# Altium schematic sheet regularCharger.SchDoc
size A4
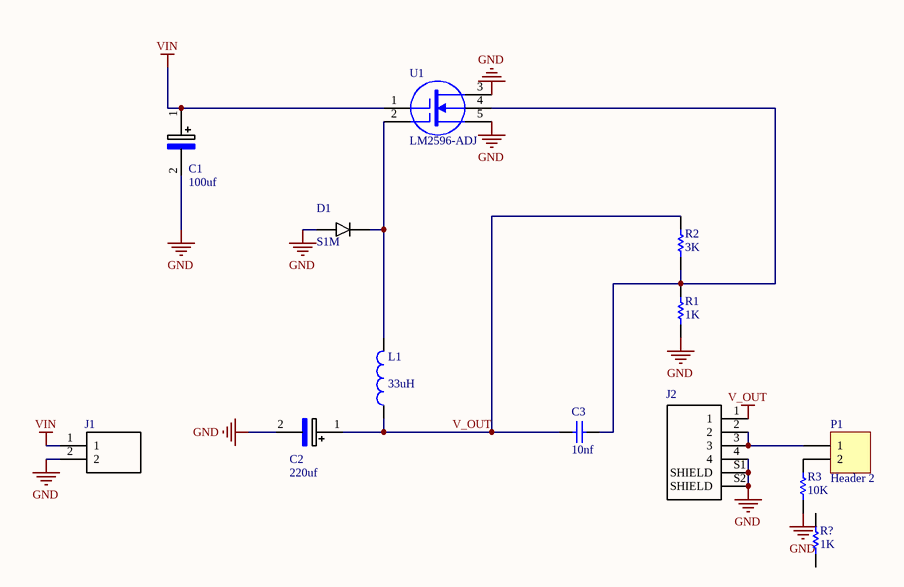
[diagram p0: regularCharger.SchDoc]

## Parts
C1  100uf  [*HAV(F)]
C2  220uf  [*HAV(F)]
C3  value 10nf  [6-0805_M]  (hidden comment: Cap)
D1  S1M  [*DIOM5227X270N_S1M(Primary)]
J1  6-1123723-2  [*TE_6-1123723-2]  (value not drawn)
J2  1-292303-1  [*TE_1-292303-1_1-292303-1(Primary)]  (value not drawn)
L1  value 33uH  [IND_SMD-13.0mm]  (hidden comment: Inductor)
P1  Header 2  [HDR1X2]
R1  value 1K  [6-0805_L]  (hidden comment: Res1)
R2  value 3K  [6-0805_L]  (hidden comment: Res1)
R3  value 10K  [6-0805_L]  (hidden comment: Res1)
R?  value 1K  [6-0805_L]  (hidden comment: Res1)
U1  LM2596-ADJ  [T05A]

## Nets
GND: C1.2(NEG) C2.2(NEG) D1.A J1.2 J2.4 J2.S1(SHIELD) J2.S2(SHIELD) R1.1 R3.1 U1.3(D) U1.5(S)
V_OUT: C2.1(POS) C3.1 J2.1 L1.1 R2.2
VIN: C1.1(POS) J1.1 U1.1(G1)
NetC3_2: C3.2 R1.2 R2.1 U1.4(U)
NetD1_C: D1.C(K) L1.2 U1.2(G2)
NetJ2_2: J2.2 J2.3 P1.1
NetP1_2: P1.2 R3.2

Not connected (* = marked no-connect by the designer): R? 1 2

## Notes on the sheet
- Title
- Size:
- Date:
- A4
- Number:
- Time:
- Revision:
- Sheet
- of
- File:

## Library data of the parts
C1 C2 = EEEHA1H101UP: Cap Aluminum 100uF 50V 20% _8 X 10.2mm_ SMD 110mA 2000 hr 105آ°C T/R; MF: Panasonic Electronic; SnapEDA_Link: https://www.snapeda.com/parts/EEEHA1H101UP/Panasonic%20Electronic%20Components/view-part/?ref=snap; MP: EEEHA1H101UP; Availability: Unavailable; Price: None; Package: Radial Panasonic Electronic; Value: *
C3 = Cap: Capacitor; Published: 8-Jun-2000; LatestRevisionDate: 17-Jul-2002; LatestRevisionNote: Re-released for DXP Platform.; PackageReference: RAD-0.3; Publisher: Altium Limited; PackageDescription: Radial Cap, Thru-Hole; 2 Leads; 0.3 in Pin Spacing
D1 = S1M: S1 Series 1000 V 1 A 1 uA Surface Mount General Purpose Rectifier - DO-214AC; MF: ON Semiconductor; Price: None; Availability: Unavailable; SnapEDA_Link: https://www.snapeda.com/parts/S1M/ON%20Semiconductor/view-part/?ref=snap; Package: DO-214AC-214 ON Semiconductor; MP: S1M; Value: *
J1 = 6-1123723-2: 3.96 EP HDR ASSY 2P_GREEN_; MF: TE Connectivity; Number_of_Positions: 2; Product_Type: Header; Centerline_Pitch: 3.96 mm[.156 in]; TE_purchase_URL: https://www.te.com/usa-en/product-6-1123723-2.html?te_bu=Cor&te_type=disp&te_campaign=seda_glo_cor-seda-global-disp-prtnr-fy19-seda-model-bom-cta_sma-317_1&elqCampaignId=32493; MP: 6-1123723-2; Price: None; Availability: Unavailable; Package: None; EU_RoHS_Compliance: Compliant; SnapEDA_Link: https://www.snapeda.com/parts/6-1123723-2/TE%20Connectivity%20AMP%20Connectors/view-part/?ref=snap; Value: *
J2 = 1-292303-1: Conn USB 2.0 Type A RCP 4 POS Solder RA SMD 4 Terminal 1 Port Box/Tray; MF: TE Connectivity; TE_purchase_URL: https://www.te.com/usa-en/product-1-292303-1.html?te_bu=Cor&te_type=disp&te_campaign=seda_glo_cor-seda-global-disp-prtnr-fy19-seda-model-bom-cta_sma-317_1&elqCampaignId=32493; SnapEDA_Link: https://www.snapeda.com/parts/1-292303-1/TE%20Connectivity%20AMP%20Connectors/view-part/?ref=snap; MP: 1-292303-1; Availability: Unavailable; Price: None; EU_RoHS_Compliance: Compliant; Package: None; Value: *
L1 = Inductor: Code_IEC: 1005; Published: 8-Jun-2000; LatestRevisionDate: 29-May-2009; LatestRevisionNote: IPC-7351 Footprint Added.; PackageReference: 0402-A; Publisher: Altium Limited; PackageDescription: Chip Inductor; Code_JEITA: 0402
P1 = Header 2: Header, 2-Pin; LatestRevisionDate: 17-Jul-2002; LatestRevisionNote: Re-released for DXP Platform.; Publisher: Altium Limited
R1-R3 R? = Res1: Resistor; Published: 8-Jun-2000; LatestRevisionDate: 17-Jul-2002; LatestRevisionNote: Re-released for DXP Platform.; PackageReference: AXIAL-0.3; Publisher: Altium Limited; PackageDescription: Axial Device, Thru-Hole; 2 Leads; 0.3 in Pin Spacing
U1 = MOSFET-N3: Two-Gate, N-Channel MOSFET, Externally Terminated Substrate; Published: 24-Mar-1999; LatestRevisionDate: 17-Jul-2002; LatestRevisionNote: Re-released for DXP Platform.; PackageReference: T05A; Publisher: Altium Limited; PackageDescription: TO-220, Molded, 5 Lead, Straight; Code_JEDEC: TS-001-AA